# EAGLE schematic Slave (EAGLE 9.1.3)
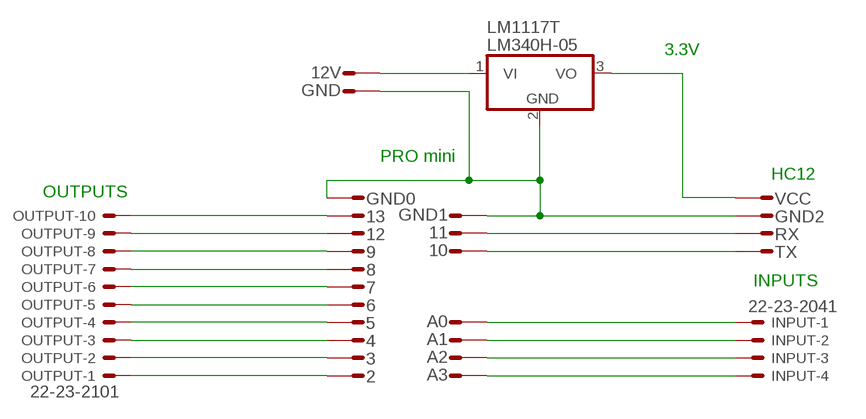
[diagram p0: schematic, sheet 1]

## Parts
2  ST2,8  [ST2,8]
3  ST2,8  [ST2,8]
4  ST2,8  [ST2,8]
5  ST2,8  [ST2,8]
6  ST2,8  [ST2,8]
7  ST2,8  [ST2,8]
8  ST2,8  [ST2,8]
9  ST2,8  [ST2,8]
10  ST2,8  [ST2,8]
11  ST2,8  [ST2,8]
12  ST2,8  [ST2,8]
12V  ST2,8  [ST2,8]
13  ST2,8  [ST2,8]
A0  ST2,8  [ST2,8]
A1  ST2,8  [ST2,8]
A2  ST2,8  [ST2,8]
A3  ST2,8  [ST2,8]
GND  ST2,8  [ST2,8]
GND0  ST2,8  [ST2,8]
GND1  ST2,8  [ST2,8]
GND2  ST2,8  [ST2,8]
INPUT  22-23-2041  [22-23-2041]
LM1117T  LM340H-05  [TO220H]
OUTPUT  22-23-2101  [22-23-2101]
RX  ST2,8  [ST2,8]
TX  ST2,8  [ST2,8]
VCC  ST2,8  [ST2,8]

## Nets
N$1: 2.1(ST) OUTPUT.1
N$2: 3.1(ST) OUTPUT.2
N$3: 4.1(ST) OUTPUT.3
N$4: 5.1(ST) OUTPUT.4
N$5: 6.1(ST) OUTPUT.5
N$6: 7.1(ST) OUTPUT.6
N$7: 8.1(ST) OUTPUT.7
N$8: 9.1(ST) OUTPUT.8
N$9: 12.1(ST) OUTPUT.9
N$10: 13.1(ST) OUTPUT.10
N$11: GND0.1(ST) GND1.1(ST) GND2.1(ST) GND.1(ST) LM1117T.2(GND)
N$12: 11.1(ST) RX.1(ST)
N$13: 10.1(ST) TX.1(ST)
N$14: LM1117T.3(VO) VCC.1(ST)
N$15: A3.1(ST) INPUT.4
N$16: A2.1(ST) INPUT.3
N$17: A1.1(ST) INPUT.2
N$18: A0.1(ST) INPUT.1
N$20: 12V.1(ST) LM1117T.1(VI)

## Notes on the sheet
- 3.3V
- PRO mini
- HC12
- OUTPUTS
- INPUTS

## Library data of the parts
2-12 12V 13 A0 A1-A3 GND GND0 GND1 GND2 RX TX VCC = con-rib:ST2,8: RIBBON CABLE CONNECTOR Flachstecker / Faston; OC_FARNELL: unknown; OC_NEWARK: unknown
INPUT = con-molex:22-23-2041: .100" (2.54mm) Center Header - 4 Pin; MF: MOLEX; MPN: 22-23-2041; OC_FARNELL: 1462920; OC_NEWARK: 38C0355
LM1117T = linear:LM340?-*: Positive VOLTAGE REGULATOR Source: http://cache.national.com/ds/LM/LM340.pdf
OUTPUT = con-molex:22-23-2101: .100" (2.54mm) Center Header - 10 Pin; MF: MOLEX; MPN: 22-23-2101; OC_FARNELL: 1756828; OC_NEWARK: 94C0765